# EAGLE design PCE128_rev_C2 (EAGLE 9.6.2)
PC Engine Joypad Breakout Version 1.0
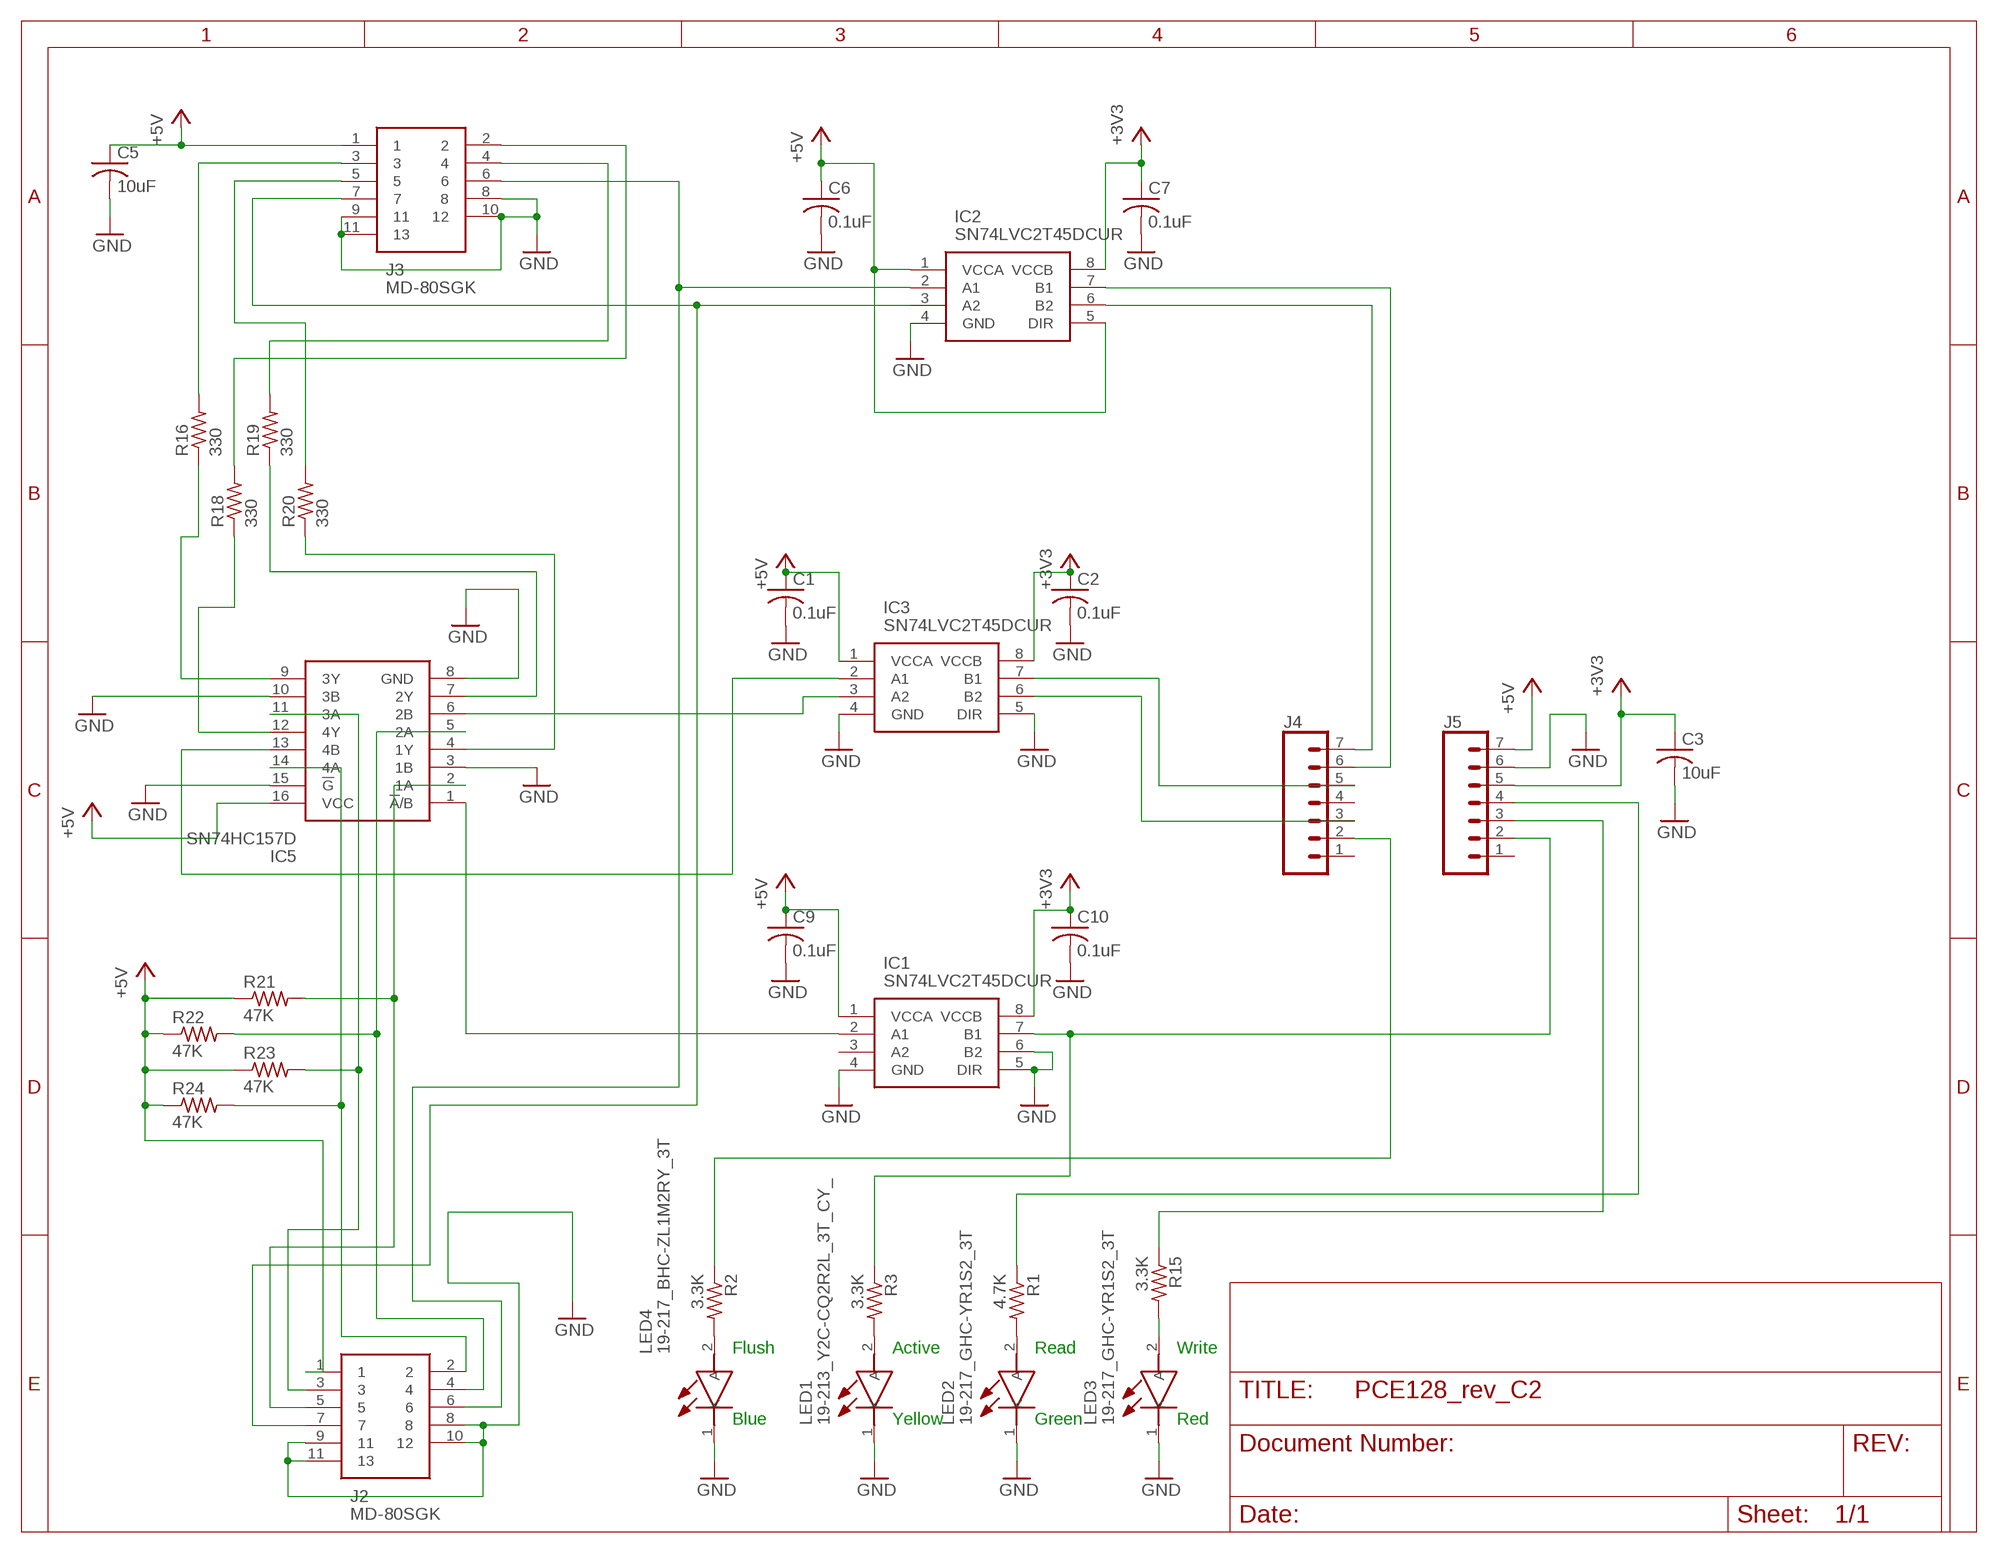
[diagram p0: schematic, sheet 1]

## Parts
C1  0.1uF  C-USC0402  [C0402]
C2  0.1uF  C-USC0402  [C0402]
C3  10uF  C-USC0805  [C0805]
C5  10uF  C-USC0805  [C0805]
C6  0.1uF  C-USC0402  [C0402]
C7  0.1uF  C-USC0402  [C0402]
C9  0.1uF  C-USC0402  [C0402]
C10  0.1uF  C-USC0402  [C0402]
IC1  SN74LVC2T45DCUR  [SOP50P310X90-8N]
IC2  SN74LVC2T45DCUR  [SOP50P310X90-8N]
IC3  SN74LVC2T45DCUR  [SOP50P310X90-8N]
IC5  SN74HC157D  [SOIC127P600X175-16N]
J2  MD-80SGK  [MD80SGK]
J3  MD-80SGK  [MD80SGK]
J4  CONN_07NO_SILK  [1X07_NO_SILK]
J5  CONN_07NO_SILK  [1X07_NO_SILK]
LED1  19-213_Y2C-CQ2R2L_3T_CY_  [LEDC1608X50N]
LED2  19-217_GHC-YR1S2_3T  [LEDC1608X50N]
LED3  19-217_GHC-YR1S2_3T  [LEDC1608X50N]
LED4  19-217_BHC-ZL1M2RY_3T  [LEDC1608X50N]
R1  4.7K  R-US_R0402  [R0402]
R2  3.3K  R-US_R0402  [R0402]
R3  3.3K  R-US_R0402  [R0402]
R15  3.3K  R-US_R0402  [R0402]
R16  330  R-US_R0402  [R0402]
R18  330  R-US_R0402  [R0402]
R19  330  R-US_R0402  [R0402]
R20  330  R-US_R0402  [R0402]
R21  47K  R-US_R0402  [R0402]
R22  47K  R-US_R0402  [R0402]
R23  47K  R-US_R0402  [R0402]
R24  47K  R-US_R0402  [R0402]

## Nets
+3V3 [power]: C2.1 C3.1 C7.1 C10.1 IC1.8(VCCB) IC2.8(VCCB) IC3.8(VCCB) J5.5
+5V [power]: C1.1 C5.1 C6.1 C9.1 IC1.1(VCCA) IC2.1(VCCA) IC2.5(DIR) IC3.1(VCCA) IC5.16(VCC) J2.1 J3.1 J5.7 R21.1 R22.1 R23.1 R24.1
CLR [signal]: IC2.3(A2) J2.7 J3.7
D0_IN [signal]: IC5.14(4A) J2.2 R24.2
D0_OUT: J3.2 R18.2
D1_IN [signal]: IC5.11(3A) J2.3 R23.2
D1_OUT: J3.3 R16.2
D2_IN: IC5.5(2A) J2.4 R22.2
D2_OUT: J3.4 R19.2
D3_IN: IC5.2(1A) J2.5 R21.2
D3_OUT: J3.5 R20.2
D6 [signal]: J5.3 R15.1
D10 [signal]: J5.4 R1.1
D11 [signal]: IC1.7(B1) J5.2 R3.1
GND: C1.2 C2.2 C3.2 C5.2 C6.2 C7.2 C9.2 C10.2 IC1.4(GND) IC1.5(DIR) IC1.6(B2) IC2.4(GND) IC3.4(GND) IC3.5(DIR) IC5.3(1B) IC5.8(GND) IC5.10(3B) IC5.15(!G) J2.8 J2.9 J2.10 J2.11 J3.8 J3.9 J3.10 J3.11 J5.6 LED1.1(K) LED2.1(K) LED3.1(K) LED4.1(K)
N$1: LED2.2(A) R1.2
N$2: J4.2 R2.1
N$3: IC3.7(B1) J4.5
N$4: LED4.2(A) R2.2
N$5: LED1.2(A) R3.2
N$6: IC3.6(B2) J4.3
N$7: IC3.3(A2) IC5.6(2B)
N$8: IC2.7(B1) J4.6
N$14: IC1.2(A1) IC5.1(!A!/B)
N$17: IC5.9(3Y) R16.1
N$20: IC5.12(4Y) R18.1
N$22: IC5.4(1Y) R20.1
N$24: IC5.7(2Y) R19.1
N$30: IC3.2(A1) IC5.13(4B)
N$32: IC2.6(B2) J4.7
N$36: LED3.2(A) R15.2
SEL [signal]: IC2.2(A1) J2.6 J3.6
Unconnected: IC1.3(A2) J4.1 J4.4 J5.1

## Notes on the sheet
- Flush | Active | Read | Write
- Blue | Yellow | Green | Red

## Library data of the parts
C1-C3 C5-C7 C9 C10 = resistor:C-US: CAPACITOR, American symbol
IC1-IC3 = PC-Engine:SN74LVC2T45DCUR: Texas Instruments SN74LVC2T45DCUR, Voltage Level Translator, Bus Transceiver, 3-State, 1.65 5.5 V, 8-Pin UM Source: Datasheet <http://www.ti.com/lit/gpn/sn74lvc2t45>; ARROW_PART_NUMBER: SN74LVC2T45DCUR; ARROW_PRICE-STOCK: https://www.arrow.com/en/products/sn74lvc2t45dcur/texas-instruments?region=nac; DESCRIPTION: Texas Instruments SN74LVC2T45DCUR, Voltage Level Translator, Bus Transceiver, 3-State, 1.65 5.5 V, 8-Pin UM; HEIGHT: 0.9mm; MANUFACTURER_NAME: Texas Instruments; MANUFACTURER_PART_NUMBER: SN74LVC2T45DCUR; MOUSER_PART_NUMBER: 595-SN74LVC2T45DCUR; MOUSER_PRICE-STOCK: https://www.mouser.co.uk/ProductDetail/Texas-Instruments/SN74LVC2T45DCUR?qs=0smPjiIwnfIdG9vxyJHBdA%3D%3D
IC5 = PC-Engine:SN74HC157D: Quadruple 2-Line To 1-Line Data Selectors/Multiplexers Source: Datasheet <http://www.ti.com/lit/ds/symlink/sn74hc157.pdf>; ARROW_PART_NUMBER: SN74HC157D; ARROW_PRICE-STOCK: https://www.arrow.com/en/products/sn74hc157d/texas-instruments; DESCRIPTION: Quadruple 2-Line To 1-Line Data Selectors/Multiplexers; HEIGHT: 1.75mm; MANUFACTURER_NAME: Texas Instruments; MANUFACTURER_PART_NUMBER: SN74HC157D; MOUSER_PART_NUMBER: 595-SN74HC157D; MOUSER_PRICE-STOCK: https://www.mouser.co.uk/ProductDetail/Texas-Instruments/SN74HC157D?qs=UGVLDq%2F29uhSeVegTExyng%3D%3D
J2 J3 = SamacSys_Parts:MD-80SGK: Circular DIN Connectors mini-DIN, 8P jack, rt, through hole, full shield Source: Datasheet <https://www.cui.com/product/resource/md-sgk-series.pdf>; DESCRIPTION: Circular DIN Connectors mini-DIN, 8P jack, rt, through hole, full shield; HEIGHT: 13mm; MANUFACTURER_NAME: CUI; MANUFACTURER_PART_NUMBER: MD-80SGK; MOUSER_PART_NUMBER: 490-MD-80SGK; MOUSER_PRICE-STOCK: https://www.mouser.com/Search/Refine.aspx?Keyword=490-MD-80SGK
J4 J5 = SparkFun-Connectors:CONN_07: Multi connection point. Often used as Generic Header-pin footprint for 0.1 inch spaced/style header connections On any of the 0.1 inch spaced packages, you can populate with these: Break Away Headers - Straight <https://www.sparkfun.com/products/116> (PRT-00116) Break Away Male Headers - Right Angle <https://www.sparkfun.com/products/553> (PRT-00553) Female Headers <https://www.sparkfun.com/products/115> (PRT-00115) Break Away Headers - Machine Pin <https://www.sparkfun.com/products/117> (PRT-00117) Break Away Female Headers - Swiss Machine Pin <https://www.sparkfun.com/products/743> (PRT-00743) For SCREWTERMINALS and SPRING TERMINALS visit here: Screw Terimnals on SparkFun.com <https://www.sparkfun.com/search/results?term=Screw+Terminals> (5mm/3.5mm/2.54mm spacing) This device is also useful as a general connection point to wire up your design to another part of your project. Our various solder wires solder well into these plated through hole pads. Hook-Up Wire - Assortment (Stranded, 22 AWG) <https://www.sparkfun.com/products/11375> (PRT-11375) Hook-Up Wire - Assortment (Solid Core, 22 AWG) <https://www.sparkfun.com/products/11367> (PRT-11367) View the entire wire category on our website here <https://www.sparkfun.com/categories/141> Special notes: Molex polarized connector foot print use with SKU : PRT-08231 with associated crimp pins and housings. 1MM SMD Version SKU: PRT-10208 NOTES ON THE VARIANTS LOCK and LOCK_LONGPADS... This footprint was designed to help hold the alignment of a through-hole component (i.e. 6-pin header) while soldering it into place. You may notice that each hole has been shifted either up or down by 0.005 of an inch from it's more standard position (which is a perfectly straight line). This slight alteration caused the pins (the squares in the middle) to touch the edges of the holes. Because they are alternating, it causes a "brace" to hold the component in place. 0.005 has proven to be the perfect amount of "off-center" position when using our standard breakaway headers. Although looks a little odd when you look at the bare footprint, once you have a header in there, the alteration is very hard to notice. Also,if you push a header all the way into place, it is covered up entirely on the bottom side.
LED1 = PC-Engine:19-213_Y2C-CQ2R2L_3T_CY_: 0603 Package Chip LED (0.6mm Height) Source: Datasheet <https://datasheet.lcsc.com/szlcsc/Everlight-Elec-19-213-Y2C-CQ2R2L-3T-CY_C72038.pdf>; ARROW_PART_NUMBER: 19-213/Y2C-CQ2R2L/3T(CY); DESCRIPTION: 0603 Package Chip LED (0.6mm Height); HEIGHT: 0.6mm; MANUFACTURER_NAME: Everlight Elec; MANUFACTURER_PART_NUMBER: 19-213/Y2C-CQ2R2L/3T(CY)
LED2 = PC-Engine:19-217_GHC-YR1S2_3T: Standard LEDs - SMD Source: Datasheet <https://www.arrow.com/en/products/19-217ghc-yr1s23t/everlight-electronics>; ARROW_PART_NUMBER: 19-217/GHC-YR1S2/3T; ARROW_PRICE-STOCK: https://www.arrow.com/en/products/19-217ghc-yr1s23t/everlight-electronics; DESCRIPTION: Standard LEDs - SMD; HEIGHT: 0.5mm; MANUFACTURER_NAME: Everlight; MANUFACTURER_PART_NUMBER: 19-217/GHC-YR1S2/3T; MOUSER_PART_NUMBER: 638-19217GHCYR1S23T; MOUSER_PRICE-STOCK: https://www.mouser.co.uk/ProductDetail/Everlight/19-217-GHC-YR1S2-3T?qs=8cKuZ6Ok2lZjmFTUzVFjDg%3D%3D
LED3 = PC-Engine:19-217_GHC-YR1S2_3T: Standard LEDs - SMD Source: Datasheet <https://www.arrow.com/en/products/19-217ghc-yr1s23t/everlight-electronics>; ARROW_PART_NUMBER: 19-217/GHC-YR1S2/3T; ARROW_PRICE-STOCK: https://www.arrow.com/en/products/19-217ghc-yr1s23t/everlight-electronics; DESCRIPTION: Standard LEDs - SMD; HEIGHT: 0.5mm; MANUFACTURER_NAME: Hubei Kento; MANUFACTURER_PART_NUMBER: KT-0603R; MOUSER_PART_NUMBER: 638-19217GHCYR1S23T; MOUSER_PRICE-STOCK: https://www.mouser.co.uk/ProductDetail/Everlight/19-217-GHC-YR1S2-3T?qs=8cKuZ6Ok2lZjmFTUzVFjDg%3D%3D
LED4 = PC-Engine:19-217_BHC-ZL1M2RY_3T
R1-R3 R15 R16 R18-R24 = resistor:R-US_: RESISTOR, American symbol

## Net classes
0 default: width 0.152 mm, drill 0.356 mm, clearance 0.152 mm
1 power: width 0.305 mm, drill 0.356 mm, clearance 0.152 mm
2 signal: width 0.152 mm, drill 0.356 mm, clearance 0.152 mm

## Board
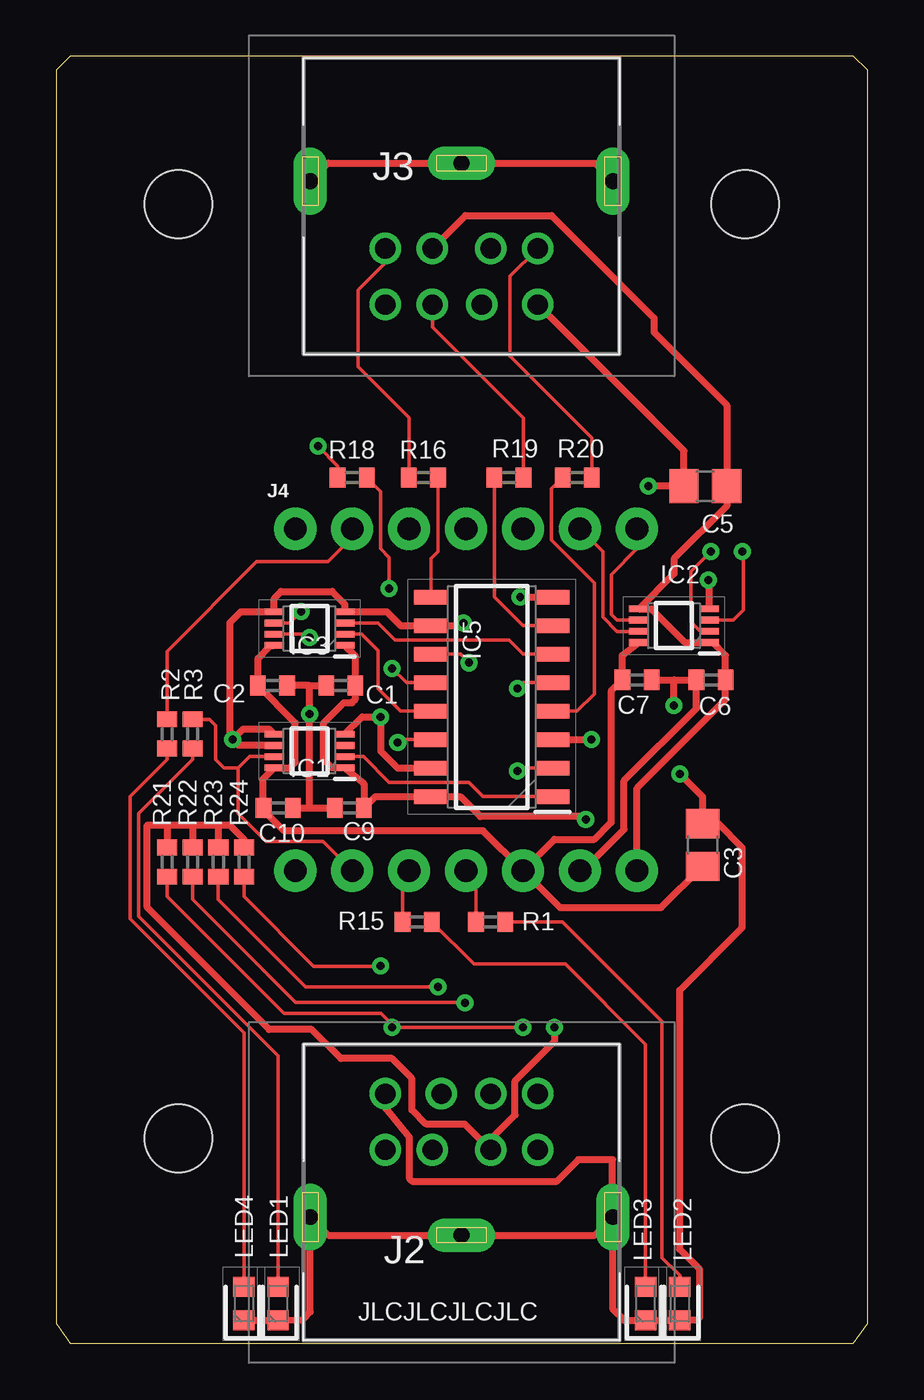
[diagram p1: board, top side]
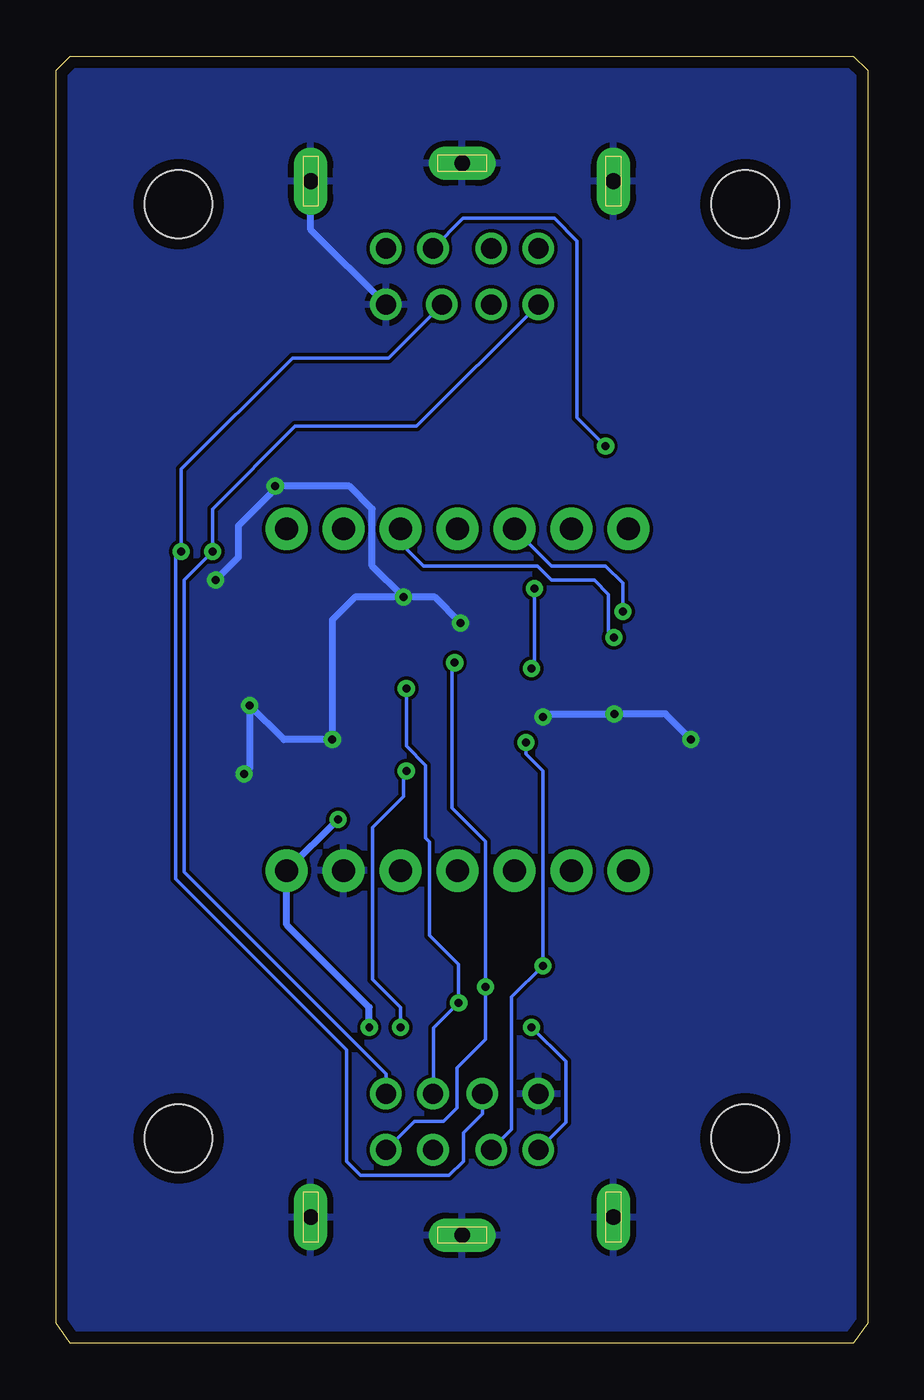
[diagram p2: board, bottom side, seen from below]

Size 36.2 x 57.4 mm. Coordinates in mm from the lower left corner, seen from the top.
Outline: 0,56.77 0,0.89 0.64,0 35.56,0 36.2,0.89 36.2,56.77 35.56,57.4 0.64,57.4 0,56.77
Copper layers (1*16): Top 0.035mm / dielectric 1.5mm / Bottom 0.035mm
Design rules "default *": minimum track width 6mil, minimum drill 0.35mm, track to track 6mil, track to pad 6mil, pad to pad 6mil, via to via 6mil, smd to smd 6mil, copper to edge 20mil, drill to drill 6mil, minimum pad ring 10mil, minimum via ring 8mil, stop-mask expansion 3mil, vias tented up to drill 18mil, thermal gap 10mil
Holes 3 mm at 5.46,50.8 30.73,50.8 5.46,9.14 30.73,9.14

### Footprints (pad centres in the part's own frame; a part is rotated, then mirrored left to right if it is on the bottom)
C0402 = smd 0.7 x 0.9: 1 -0.65,0; 2 0.65,0
C0805 = smd 1.3 x 1.5: 1 -0.95,0; 2 0.95,0
SOP50P310X90-8N = smd 0.85 x 0.3: 1 -1.575,0.75; 2 -1.575,0.25; 3 -1.575,-0.25; 4 -1.575,-0.75; 5 1.575,-0.75; 6 1.575,-0.25; 7 1.575,0.25; 8 1.575,0.75
SOIC127P600X175-16N = smd 1.525 x 0.65: 1 -2.712,4.445; 2 -2.712,3.175; 3 -2.712,1.905; 4 -2.712,0.635; 5 -2.712,-0.635; 6 -2.712,-1.905; 7 -2.712,-3.175; 8 -2.712,-4.445; 9 2.712,-4.445; 10 2.712,-3.175; 11 2.712,-1.905; 12 2.712,-0.635; 13 2.712,0.635; 14 2.712,1.905; 15 2.712,3.175; 16 2.712,4.445
MD80SGK = drill 0.9 pad 1.4: 1 -1.3,-1.9; 2 1.3,-1.9; 3 -3.4,-1.9; 4 -1.3,-4.4; 5 3.4,-1.9; 6 -3.4,-4.4; 7 0.9,-4.4; 8 3.4,-4.4 | drill 0.7 pad 1.5 long: 9 0,1.9; 10 -6.75,1.1; 11 6.75,1.1
1X07_NO_SILK = drill 1.016 pad 1.88: 1 0,0; 2 2.54,0; 3 5.08,0; 4 7.62,0; 5 10.16,0; 6 12.7,0; 7 15.24,0
LEDC1608X50N = smd 0.9 x 0.95: 1 -0.75,0; 2 0.75,0
R0402 = smd 0.7 x 0.9: 1 -0.65,0; 2 0.65,0

### Placement (x,y rotation side)
C1  12.7,29.34 180 top
C2  9.65,29.34 0 top
C3  28.83,22.23 90 top
C5  28.96,38.23 180 top
C6  29.21,29.59 180 top
C7  25.91,29.59 0 top
C9  13.08,23.88 180 top
C10  9.91,23.88 0 top
IC1  11.3,26.42 180 top
IC2  27.56,32 180 top
IC3  11.3,31.88 180 top
IC5  19.43,28.83 180 top
J2  18.08,6.73 180 top
J3  18.08,50.72 0 top
J4  10.67,36.32 0 top
J5  10.67,21.08 0 top
LED1  9.91,1.78 90 top
LED2  27.81,1.78 90 top
LED3  26.29,1.78 90 top
LED4  8.38,1.78 90 top
R1  19.38,18.8 0 top
R2  4.95,27.18 270 top
R3  6.1,27.18 270 top
R15  16.1,18.8 0 top
R16  16.38,38.61 180 top
R18  13.21,38.61 180 top
R19  20.19,38.61 0 top
R20  23.24,38.61 0 top
R21  4.95,21.46 270 top
R22  6.1,21.46 270 top
R23  7.24,21.46 270 top
R24  8.38,21.46 270 top

### Tracks (layer width: path | path; a pad name or v marks a point on that pad's centre or on a via)
+3V3
  Top 0.305: J5.5 19.05,22.86 10.16,22.86 9.26,23.76 C10.1 9.22,23.91 9.22,25.16 IC1.8 10.43,25.67 10.67,25.91 10.67,27.67 C2.1 9,30.55 9.58,31.13 IC3.8 | IC2.8 25.26,30.68 C7.1 24.75,29.08 24.75,23.23 24,22.48 22.23,22.48 J5.5 | J5.5 22.48,19.43 26.98,19.43 C3.1
+5V  (via drill 0.36)
  Top 0.305: J5.7 25.91,24.77 29.86,28.72 C6.1 29.86,30.68 29.28,31.25 IC2.1 28.05,31.25 26.55,32.75 IC2.5 27.56,34.33 27.56,34.99 29.91,37.34 C5.1 29.91,41.85 26.67,45.09 26.67,45.72 22.1,50.29 18.25,50.29 J3.1 | v23.62,23.37 23.5,23.5 18.92,23.5 18.03,24.38 IC5.16 14.24,24.38 C9.1 13.73,24.96 IC1.1 12.31,25.67 11.94,26.04 11.94,27.67 12.84,28.57 13.21,28.57 13.35,28.72 C1.1 13.35,30.66 IC3.1 | v22.23,14.1 22.23,13.46 20.48,11.71 20.48,10.19 19.39,9.1 J2.1 18.24,9.78 16.51,9.78 15.88,10.41 15.88,11.81 14.99,12.7 12.7,12.7 11.4,13.99 9.5,13.99 4.06,19.43 4.06,23.11 4.95,23.11 | 4.95,23.11 6.1,23.11 | 6.1,23.11 7.24,23.11 | 7.24,23.11 7.75,23.11 8.38,22.48 R24.1 | 7.24,23.11 R23.1 | 6.1,23.11 R22.1 | 4.95,23.11 R21.1
  Bottom 0.305: v23.62,23.37 J5.7 25.91,18.67 22.23,14.99 v22.23,14.1
CLR  (via drill 0.36)
  Top 0.152: v30.61,35.31 30.65,35.26 30.65,32.71 30.28,32.33 30.27,32.33 30.2,32.25 IC2.3
  Bottom 0.152: J3.7 21.37,43.94 25.65,43.94 30.61,38.99 v30.61,35.31 30.86,35.05 30.86,20.7 23.24,13.08 23.24,8.13 22.61,7.49 18.67,7.49 18.03,8.13 18.03,9.39 17.18,10.24 J2.7
D0_IN  (via drill 0.36)
  Top 0.152: v15.24,26.8 15.37,26.92 IC5.14 | v14.48,16.84 14.45,16.82 11.49,16.82 8.38,19.92 R24.2
  Bottom 0.152: J2.2 15.88,9.54 15.88,15.44 v14.48,16.84 14.48,25.53 15.24,26.29 v15.24,26.8
D0_OUT  (via drill 0.36)
  Top 0.152: R18.2 12.56,39.13 v11.68,40.01
  Bottom 0.152: J3.2 18.04,50.16 13.97,50.16 12.95,49.15 12.95,41.27 v11.68,40.01
D1_IN  (via drill 0.36)
  Top 0.152: v18.41,30.35 18.03,30.73 IC5.11 | R23.2 7.24,19.8 11.14,15.9 v17.04,15.9
  Bottom 0.152: J2.3 20.21,9.91 18.92,9.91 18.31,10.5 18.31,12.28 17.04,13.56 v17.04,15.9 17.04,22.38 18.54,23.88 18.54,30.23 v18.41,30.35
D1_OUT
  Top 0.152: J3.3 14.69,48.19 13.46,46.97 13.46,43.56 15.73,41.29 R16.2
D2_IN  (via drill 0.36)
  Top 0.152: v20.57,29.21 20.83,29.46 IC5.5 | R22.2 6.1,19.8 10.68,15.21 18.21,15.21 v18.24,15.19
  Bottom 0.152: v20.57,29.21 20.57,26.64 19.71,25.78 19.71,22.53 19.53,22.35 19.53,18.19 18.24,16.89 v18.24,15.19 19.36,14.07 19.36,11.16 J2.4
D2_OUT
  Top 0.152: J3.4 16.79,45.32 20.84,41.26 R19.2
D3_IN  (via drill 0.36)
  Top 0.152: v20.57,25.53 20.7,25.65 IC5.2 | v20.83,14.1 15.11,14.1 | 15.11,14.1 v14.99,14.1 | R21.2 4.95,19.92 10.17,14.71 14.5,14.71 15.11,14.1
  Bottom 0.152: v20.83,14.1 20.83,14.99 22.07,16.23 22.07,23.01 20.7,24.38 20.7,25.4 v20.57,25.53 | v14.99,14.1 13.46,12.57 13.46,9.85 J2.5
D3_OUT
  Top 0.152: J3.5 20.24,47.58 20.24,44.02 23.89,40.37 R20.2
D6
  Top 0.152: R15.1 15.45,20.79 J5.3
D10
  Top 0.152: R1.1 18.73,20.64 J5.4
D11
  Top 0.152: 8.13,25.65 8.13,23.62 9.37,22.38 11.91,22.38 J5.2 | 8.13,25.65 7.49,25.65 7.11,26.04 7.11,27.56 6.84,27.83 R3.1 | IC1.7 8.64,26.17 8.13,25.65
GND  (via drill 0.36)
  Top 0.305: J2.8 14.69,10.5 15.75,9.21 15.75,7.37 15.88,7.24 22.34,7.24 23.29,8.19 24.82,8.19 24.82,5.65 | 24.82,5.65 J2.10 24.04,4.83 J2.9 12.13,4.83 J2.11 11.34,1.4 10.98,1.05 10.96,1.05 LED1.1 LED4.1 | J3.10 12.14,52.63 J3.9 24.04,52.62 J3.11 | 24.82,5.65 24.82,1.55 25.34,1.03 LED3.1 LED2.1 28.57,1.03 28.71,1.16 28.71,3.3 27.82,4.19 27.81,4.19 27.81,15.75 30.61,18.54 30.61,22.1 29.53,23.18 C3.2 28.83,24.38 v27.81,25.4 | C10.2 11.3,23.88 | 11.3,23.88 C9.2 | 11.3,23.88 v11.3,28.07 11.3,29.34 | 11.3,29.34 C1.2 | 11.3,29.34 C2.2 | J5.6 23.5,21.08 25.34,22.92 25.34,25.1 28.56,28.32 C6.2 27.56,29.59 | C7.2 27.56,29.59 | v7.87,26.92 8.34,27.39 9.5,27.39 IC1.5 | v27.56,28.45 27.56,29.59 | IC5.3 v23.88,26.92 | IC5.15 15.24,25.65 14.48,26.42 v14.48,27.94 13.65,27.94 IC1.4 | v18.16,32.13 18.03,32 IC5.10 15.37,32 14.74,32.63 IC3.4 12.88,32.97 12.32,33.53 10.03,33.53 9.73,33.22 IC3.5 8.24,32.63 7.75,32.13 7.75,27.05 v7.87,26.92 | v20.7,33.27 IC5.8 | J3.8 28.01,39.8 C5.2 v26.42,38.23 | IC2.4 29.13,33.98 v29.08,34.04 | IC1.6 8.13,26.67 v7.87,26.92
  Bottom 0.305: J3.8 24.84,49.67 J3.11 | v7.87,26.92 9.02,28.07 v11.3,28.07 14.35,28.07 v14.48,27.94 | v18.16,32.13 19.3,33.27 v20.7,33.27 | v20.7,33.27 22.86,33.27 23.88,32.26 v23.88,26.92 26.04,26.92 v27.56,28.45 27.56,25.65 v27.81,25.4 | v20.7,33.27 22.1,34.67 22.1,37.21 23.11,38.23 v26.42,38.23 26.42,38.1 28.07,36.45 28.07,35.05 v29.08,34.04
  pour Bottom: -0.51,-0.51 -0.51,57.78 38.1,57.78 38.1,-0.51
N$1
  Top 0.152: R1.2 22.58,18.8 27.01,14.36 27.01,3.83 27.81,3.03 LED2.2
N$2
  Top 0.152: J4.2 13.21,35.94 12.13,34.86 8.95,34.86 4.95,30.86 R2.1
N$3  (via drill 0.36)
  Top 0.152: IC3.7 11.17,31.63 v11.31,31.48
  Bottom 0.152: J4.5 20.83,35.69 19.81,34.67 14.73,34.67 14.1,34.04 12.19,34.04 11.56,33.4 11.56,31.73 v11.31,31.48
N$4
  Top 0.152: R2.2 4.95,26.04 3.3,24.38 3.3,18.92 8.38,13.84 LED4.2
N$5
  Top 0.152: R3.2 6.1,26.04 3.68,23.62 3.68,19.05 9.91,12.83 LED1.2
N$6  (via drill 0.36)
  Top 0.152: IC3.6 10.41,32.13 v10.92,32.64
  Bottom 0.152: v10.92,32.64 10.92,33.91 11.68,34.67 14.1,34.67 J4.3
N$7
  Top 0.152: IC5.6 20.83,30.73 20.19,31.37 15.11,31.37 14.54,31.94 14.36,32.13 IC3.3
N$8
  Top 0.152: J4.6 24.38,35.31 24.38,32.38 25.02,31.75 IC2.7
N$14
  Top 0.152: IC5.1 19.05,24.38 18.41,25.02 14.86,25.02 13.71,26.17 IC1.2
N$17
  Top 0.152: IC5.9 16.72,35.01 17.03,35.32 R16.1
N$20  (via drill 0.36)
  Top 0.152: IC5.12 15.62,29.46 v14.99,30.1 | R18.1 14.48,37.99 14.48,35.43 14.86,35.05 v14.86,33.66
  Bottom 0.152: v14.99,30.1 14.86,30.23 v14.86,33.66
N$22
  Top 0.152: IC5.4 23.24,28.19 24,28.96 24,33.91 22.1,35.81 22.1,38.12 R20.1
N$24
  Top 0.152: IC5.7 20.83,32 19.54,33.29 R19.1
N$30
  Top 0.152: IC5.13 15.37,28.19 14.35,29.21 14.35,30.9 13.63,31.63 IC3.2
N$32
  Top 0.152: J4.7 25.91,35.43 24.77,34.29 24.77,32.51 25.02,32.25 IC2.6
N$36
  Top 0.152: R15.2 18.63,16.92 22.71,16.92 26.29,13.34 LED3.2
SEL  (via drill 0.36)
  Top 0.152: v29.21,35.31 28.32,34.42 28.32,32.17 28.74,31.75 IC2.2
  Bottom 0.152: J3.6 20.11,40.89 25.53,40.89 29.21,37.21 v29.21,35.31 30.48,34.04 30.48,21.02 21.48,12.02 J2.6

### Text on the board
tNames: JLCJLCJLCJLC
tValues: PCE128, rev. C2 | (C)2021 David Shadoff